# Altium project FL-0004 Power Rail Probe.PrjPcb (part 2 of 3)

## Sheet Microcontroller.SchDoc: Microcontroller and HMI
size Tabloid; Organization: Davis Designs; Address1: Flycatcher Labs; SheetNumber: 3; SheetTotal: 6
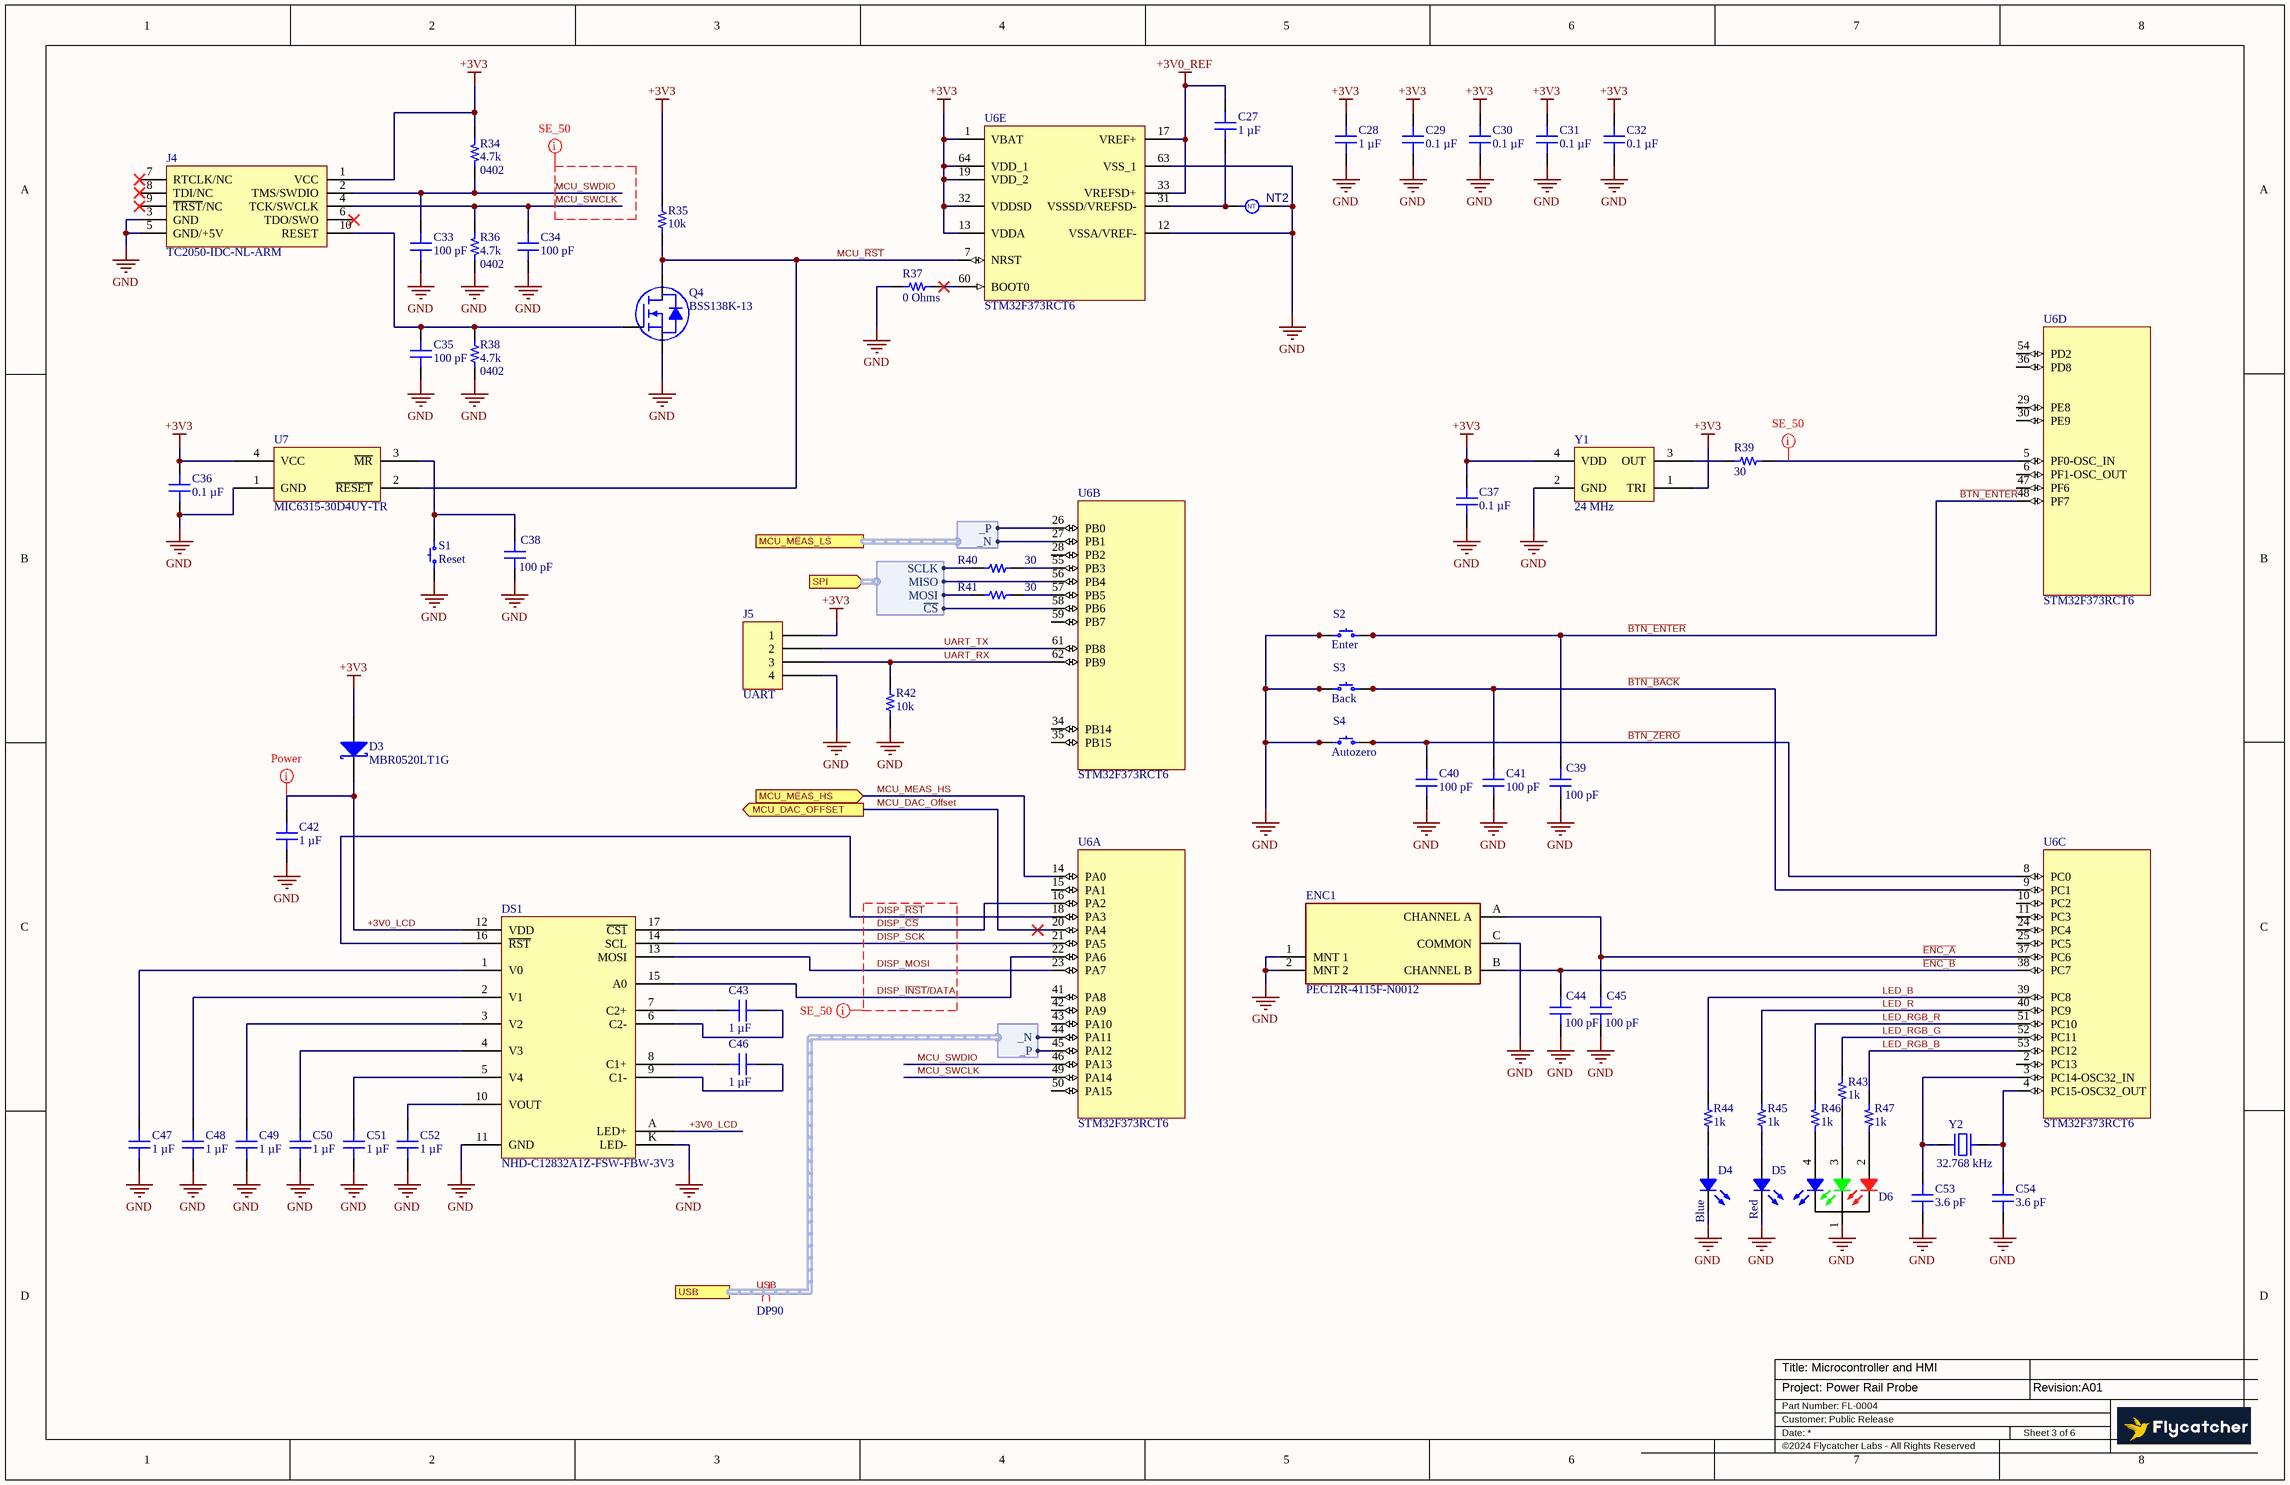
[diagram p3: Microcontroller.SchDoc]

### Parts
C27  1 µF  [MURATA GRM155 0402_1005]
C28  1 µF  [MURATA GRM155 0402_1005]
C29  0.1 µF  [MURATA GRM155 0402_1005]
C30  0.1 µF  [MURATA GRM155 0402_1005]
C31  0.1 µF  [MURATA GRM155 0402_1005]
C32  0.1 µF  [MURATA GRM155 0402_1005]
C33  100 pF  [MURATA GCM155 0402_1005]
C34  100 pF  [MURATA GCM155 0402_1005]
C35  100 pF  [MURATA GCM155 0402_1005]
C36  0.1 µF  [MURATA GRM155 0402_1005]
C37  0.1 µF  [MURATA GRM155 0402_1005]
C38  100 pF  [MURATA GCM155 0402_1005]
C39  100 pF  [MURATA GCM155 0402_1005]
C40  100 pF  [MURATA GCM155 0402_1005]
C41  100 pF  [MURATA GCM155 0402_1005]
C42  1 µF  [MURATA GRM155 0402_1005]
C43  1 µF  [MURATA GRM155 0402_1005]
C44  100 pF  [MURATA GCM155 0402_1005]
C45  100 pF  [MURATA GCM155 0402_1005]
C46  1 µF  [MURATA GRM155 0402_1005]
C47  1 µF  [MURATA GRM155 0402_1005]
C48  1 µF  [MURATA GRM155 0402_1005]
C49  1 µF  [MURATA GRM155 0402_1005]
C50  1 µF  [MURATA GRM155 0402_1005]
C51  1 µF  [MURATA GRM155 0402_1005]
C52  1 µF  [MURATA GRM155 0402_1005]
C53  3.6 pF  [MURATA GJM155 0402_1005]
C54  3.6 pF  [MURATA GJM155 0402_1005]
D3  MBR0520LT1G  [ONSC-SOD-123-2-425-04_V]
D4  Blue  [LED 0402_1005 BLUE]
D5  Red  [LED 0402_1005 RED]
D6  APTF1616LSEKJ3ZGKQBC  [APTF1616LSEKJ3ZGKQBC-Footprint-1]  (value not drawn)
DS1  NHD-C12832A1Z-FSW-FBW-3V3  [NHD-C12832A1Z WHITE]
ENC1  PEC12R-4115F-N0012  [FP-PEC12R-4115F-N0012-MFG]
J4  TC2050-IDC-NL-ARM  [TC2050-IDC-NL-Footprint-1]  (no BOM)
J5  UART  [HARWIN M20-9960445]
NT2  Net Tie 10x8mil  [New footprint 1]  (value not drawn)  (net tie, no BOM)
Q4  BSS138K-13  [DIODES SOT-23-3]
R34  4.7k  Supplier Device Package: 0402  [RES 0402_1005]
R35  10k  [RES 0402_1005]
R36  4.7k  Supplier Device Package: 0402  [RES 0402_1005]
R37  0 Ohms  [RES 0402_1005]
R38  4.7k  Supplier Device Package: 0402  [RES 0402_1005]
R39  30  [RES 0402_1005]
R40  30  [RES 0402_1005]
R41  30  [RES 0402_1005]
R42  10k  [RES 0402_1005]
R43  1k  [RES 0402_1005]
R44  1k  [RES 0402_1005]
R45  1k  [RES 0402_1005]
R46  1k  [RES 0402_1005]
R47  1k  [RES 0402_1005]
S1  Reset  [C&K KSS]
S2  Enter  [OMRON B3FS-1012P]
S3  Back  [OMRON B3FS-1012P]
S4  Autozero  [OMRON B3FS-1012P]
U6  STM32F373RCT6  [STM-LQFP64_M]  (parts A,B,C,D,E of 5)
U7  MIC6315-30D4UY-TR  [MICROCHIP SOT-143-4]
Y1  24 MHz  [ABRACON ASE]
Y2  32.768 kHz  [ABRACON ABS06]

### Ports
MCU_DAC_OFFSET (out), MCU_MEAS_HS (in), MCU_MEAS_LS (harness DP), SPI (in, harness SPI), USB (harness DP)

### Harnesses
DP: _P, _N
SPI: MOSI, MISO, ~{CS}, SCLK

### Nets
+3V0_REF: C27.2 U6.17(VREF+) U6.33(VREFSD+)
+3V3: C28.2 C29.2 C30.2 C31.2 C32.2 C36.2 C37.2 D3.1(A) J4.1(VCC) J5.1 R34.2 R35.2 U6.1(VBAT) U6.13(VDDA) U6.19(VDD_2) U6.32(VDDSD) U6.64(VDD_1) U7.4(VCC) Y1.1(TRI) Y1.4(VDD)
GND: C28.1 C29.1 C30.1 C31.1 C32.1 C33.1 C34.1 C35.1 C36.1 C37.1 C38.1 C39.1 C40.1 C41.1 C42.1 C44.1 C45.1 C47.1 C48.1 C49.1 C50.1 C51.1 C52.1 C53.1 C54.1 D4.2 D5.2 D6.1(K) DS1.11(GND) DS1.K(LED-) ENC1.1(MNT_1) ENC1.2(MNT_2) ENC1.C(COMMON) J4.3(GND) J4.5(GND/+5V) J5.4 NT2.2 Q4.2(S) R36.1 R37.1 R38.1 R42.1 S1.1 S2.1 S2.2 S3.1 S3.2 S4.1 S4.2 U6.12(VSSA/VREF-) U6.63(VSS_1) U7.1(GND) Y1.2(GND)
+3V0_LCD: C42.2 D3.2(K) DS1.12(VDD) DS1.A(LED+)
~{BTN_BACK}: C41.2 S3.3 S3.4 U6.9(PC1)
~{BTN_ENTER}: C39.2 S2.3 S2.4 U6.48(PF7)
~{BTN_ZERO}: C40.2 S4.3 S4.4 U6.8(PC0)
~{ENC_A}: C45.2 ENC1.A(CHANNEL_A) U6.37(PC6)
~{ENC_B}: C44.2 ENC1.B(CHANNEL_B) U6.38(PC7)
DISP_~{CS}: DS1.17(~{CS1}) U6.16(PA2)
DISP_~{INST}/DATA: DS1.15(A0) U6.22(PA6)
DISP_MOSI: DS1.13(MOSI) U6.23(PA7)
DISP_~{RST}: DS1.16(~{RST}) U6.18(PA3)
DISP_SCK: DS1.14(SCL) U6.21(PA5)
LED_B: R44.2 U6.39(PC8)
LED_R: R45.2 U6.40(PC9)
LED_RGB_B: R47.2 U6.53(PC12)
LED_RGB_G: R43.2 U6.52(PC11)
LED_RGB_R: R46.2 U6.51(PC10)
MCU_DAC_Offset: U6.20(PA4) ; port MCU_DAC_OFFSET
MCU_MEAS_HS: U6.14(PA0) ; port MCU_MEAS_HS
MCU_MEAS_LS._N: U6.27(PB1) ; port MCU_MEAS_LS._N
MCU_MEAS_LS._P: U6.26(PB0) ; port MCU_MEAS_LS._P
MCU_~{RST}: Q4.3(D) R35.1 U6.7(NRST) U7.2(~{RESET})
MCU_SWCLK: C34.2 J4.4(TCK/SWCLK) R36.2 U6.49(PA14)
MCU_SWDIO: C33.2 J4.2(TMS/SWDIO) R34.1 U6.46(PA13)
SPI_TRIM~{.}CS: U6.58(PB6) ; port SPI.~{CS}
SPI_TRIM.MISO: U6.56(PB4) ; port SPI.MISO
SPI_TRIM.MOSI: R41.1 ; port SPI.MOSI
SPI_TRIM.SCLK: R40.1 ; port SPI.SCLK
UART_RX: J5.3 R42.2 U6.62(PB9)
UART_TX: J5.2 U6.61(PB8)
USB._N: U6.44(PA11) ; port USB._N
USB._P: U6.45(PA12) ; port USB._P
NetC27_1: C27.1 NT2.1 U6.31(VSSSD/VREFSD-)
NetC35_2: C35.2 J4.10(RESET) Q4.1(G) R38.2
NetC38_2: C38.2 S1.2 U7.3(~{MR})
NetC43_1: C43.1 DS1.6(C2-)
NetC43_2: C43.2 DS1.7(C2+)
NetC46_1: C46.1 DS1.9(C1-)
NetC46_2: C46.2 DS1.8(C1+)
NetC47_2: C47.2 DS1.1(V0)
NetC48_2: C48.2 DS1.2(V1)
NetC49_2: C49.2 DS1.3(V2)
NetC50_2: C50.2 DS1.4(V3)
NetC51_2: C51.2 DS1.5(V4)
NetC52_2: C52.2 DS1.10(VOUT)
NetC53_2: C53.2 U6.3(PC14-OSC32_IN) Y2.1
NetC54_2: C54.2 U6.4(PC15-OSC32_OUT) Y2.2
NetD4_1: D4.1 R44.1
NetD5_1: D5.1 R45.1
NetD6_2: D6.2(R) R47.1
NetD6_3: D6.3(G) R43.1
NetD6_4: D6.4(B) R46.1
NetR37_2: R37.2 U6.60(BOOT0)
NetR39_1: R39.1 Y1.3(OUT)
NetR39_2: R39.2 U6.5(PF0-OSC_IN)
NetR40_2: R40.2 U6.55(PB3)
NetR41_2: R41.2 U6.57(PB5)

Not connected (* = marked no-connect by the designer): J4 6(TDO/SWO)* 7(RTCLK/NC)* 8(TDI/NC)* 9(~{TRST}/NC)*; U6 2(PC13) 6(PF1-OSC_OUT) 10(PC2) 11(PC3) 15(PA1) 24(PC4) 25(PC5) 28(PB2) 29(PE8) 30(PE9) 34(PB14) 35(PB15) 36(PD8) 41(PA8) 42(PA9) 43(PA10) 47(PF6) 50(PA15) 54(PD2) 59(PB7)

### Buses and harness runs
harness USB = port USB

### Layout directives
differential pair; differential pair class DP90: (no net found under the mark)
net class SE_50: DISP_MOSI, DISP_SCK, DISP_~{CS}, DISP_~{INST}/DATA, DISP_~{RST}, MCU_SWCLK, MCU_SWDIO, NetR39_2
net class Power: +3V0_LCD

### Notes on the sheet
- (in symbol CMP-009-00116-4) NT

### Library data of the parts
C27 C28 C42 C43 C46-C52 = GRM155R61E105MA12D: CAP CER 1UF 25V X5R 0402; manufacturer: Murata Electronics; Tolerance: ±20%; Part Number: GRM155R61E105MA12D; Value: 1 µF; Applications: General Purpose; Capacitance: 1 µF; componentlink1description: Datasheet; componentlink1url: https://search.murata.co.jp/Ceramy/image/img/A01X/G101/ENG/GRM155R61E105MA12-01.pdf; componentlink2description: DigiKey Link; componentlink2url: https://www.digikey.com/en/products/detail/murata-electronics/GRM155R61E105MA12D/4905141; Device Package: 0402 (1005 Metric); lastupdated: 7/25/2024 4:50:24 AM; Lifecycle Status: Active; Minimum Order: 1; Mounting Type: Surface Mount, MLCC; Operating Temperature: -55°C ~ 85°C; Package / Case: 0402 (1005 Metric); packaging: TapeAndReel; partid: 3014; Part Status: Active; price: 0.01; series: GRM; Size / Dimension: 0.039" L x 0.020" W (1.00mm x 0.50mm); Supplier 1: DigiKey; Supplier Part Number 1: 490-10018-1-ND; Temperature Coefficient: X5R; Thickness (Max): 0.022" (0.55mm); Voltage - Rated: 25V
C29-C32 C36 C37 = GRM155R61H104KE19D: CAP CER 0.1UF 50V X5R 0402; manufacturer: Murata Electronics; Tolerance: ±10%; Part Number: GRM155R61H104KE19D; Value: 0.1 µF; Applications: General Purpose; Capacitance: 0.1 µF; componentlink1description: Datasheet; componentlink1url: https://search.murata.co.jp/Ceramy/image/img/A01X/G101/ENG/GRM155R61H104KE19-01.pdf; componentlink2description: DigiKey Link; componentlink2url: https://www.digikey.com/en/products/detail/murata-electronics/GRM155R61H104KE19D/5360887; Device Package: 0402 (1005 Metric); lastupdated: 7/25/2024 4:50:24 AM; Lifecycle Status: Active; Minimum Order: 1; Mounting Type: Surface Mount, MLCC; Operating Temperature: -55°C ~ 85°C; Package / Case: 0402 (1005 Metric); packaging: TapeAndReel; partid: 2975; Part Status: Active; price: 0.01; series: GRM; Size / Dimension: 0.039" L x 0.020" W (1.00mm x 0.50mm); Supplier 1: DigiKey; Supplier Part Number 1: 490-11917-1-ND; Temperature Coefficient: X5R; Thickness (Max): 0.022" (0.55mm); Voltage - Rated: 50V
C33-C35 C38-C41 C44 C45 = GCM1555C1H101FA16D: CAP CER 100PF 50V C0G/NP0 0402; manufacturer: Murata Electronics; Temperature Coefficient: C0G, NP0; Tolerance: ±1%; Part Number: GCM1555C1H101FA16D; Value: 100 pF; Applications: Automotive; Capacitance: 100 pF; componentlink1description: Datasheet; componentlink1url: https://search.murata.co.jp/Ceramy/image/img/A01X/G101/ENG/GCM1555C1H101FA16-01.pdf; componentlink2description: DigiKey Link; componentlink2url: https://www.digikey.com/en/products/detail/murata-electronics/GCM1555C1H101FA16D/6605978; Device Package: 0402 (1005 Metric); lastupdated: 7/20/2024 2:04:18 AM; Lifecycle Status: Active; Minimum Order: 1; Mounting Type: Surface Mount, MLCC; Operating Temperature: -55°C ~ 125°C; Package / Case: 0402 (1005 Metric); packaging: TapeAndReel; partid: 7484; Part Status: Active; price: 0.01; Ratings: AEC-Q200; series: GCM; Size / Dimension: 0.039" L x 0.020" W (1.00mm x 0.50mm); Supplier 1: DigiKey; Supplier Part Number 1: 490-14349-1-ND; Thickness (Max): 0.022" (0.55mm); Voltage - Rated: 50V
C53 C54 = GJM1555C1H3R6CB01D: CAP CER 3.6PF 50V C0G/NP0 0402; manufacturer: Murata Electronics; Temperature Coefficient: C0G, NP0; Tolerance: ±0.25pF; Part Number: GJM1555C1H3R6CB01D; Value: 3.6 pF; Applications: RF, Microwave, High Frequency; Capacitance: 3.6 pF; componentlink1description: Datasheet; componentlink1url: https://search.murata.co.jp/Ceramy/image/img/A01X/G101/ENG/GJM1555C1H3R6CB01-01.pdf; componentlink2description: DigiKey Link; componentlink2url: https://www.digikey.com/en/products/detail/murata-electronics/GJM1555C1H3R6CB01D/702289; Device Package: 0402 (1005 Metric); Features: High Q, Low Loss; lastupdated: 7/20/2024 12:08:45 AM; Lifecycle Status: Active; Minimum Order: 1; Mounting Type: Surface Mount, MLCC; Operating Temperature: -55°C ~ 125°C; Package / Case: 0402 (1005 Metric); packaging: TapeAndReel; partid: 8570; Part Status: Active; price: 0.01; series: GJM; Size / Dimension: 0.039" L x 0.020" W (1.00mm x 0.50mm); Supplier 1: DigiKey; Supplier Part Number 1: 490-3096-1-ND; Thickness (Max): 0.022" (0.55mm); Voltage - Rated: 50V
D3 = CMP-004-00003-2: Schottky Power Rectifier, 20 V, 5.5 A, -65 to 125 degC, 2-Pin SMD, RoHS, Tape and Reel; Manufacturer: ON Semiconductor; Forward Current: 500mA; Peak Reverse Current: 250uA; Elements: 1; Forward Voltage: 385mV; Max Surge Current: 5.5A; Max Operating Temperature: 125°C; Min Operating Temperature: -65°C; Mounting Technology: SM; Datasheet URL: http://www.onsemi.cn/pub_link/Collateral/MBR0520LT1-D.PDF; RoHS Compliant: True; Pins: 2; Package Quantity: 3000; Case/Package: SOD; Package Reference: SOD-123-2-425-04; Package Description: 2-Pin Surface Mount Device, Body 2.69 x 1.6 mm; Packaging: TapeandReel; Manufacturer URL: http://www.onsemi.com/; Datasheet Version: Rev. 6, 01/2012
D4 = SML-LXR0401USBW5MA: 1.0X0.55X0.3 MM. SMT SIDE VIEW L; Manufacturer: Lumex Opto/Components Inc.; Configuration: Independent; Current - Test: 5mA; Lens Color: White; Lens Size: 1.00mm x 0.30mm; Lens Style: Rectangle with Flat Top; Lens Transparency: Diffused; Millicandela Rating: 28mcd; Viewing Angle: 145°; Voltage - Forward (Vf) (Typ): 2.8V; Wavelength - Peak: 470nm; Part Number: SML-LXR0401USBW5MA; Color: Blue; ComponentLink1Description: Datasheet; ComponentLink1URL: https://media.digikey.com/pdf/Data%20Sheets/Lumex%20PDFs/SML-LXR0401USBW5MA_Dwg_RevA_2-10-20.pdf; ComponentLink2Description: DigiKey Link; ComponentLink2URL: https://www.digikey.com/en/products/detail/lumex-opto-components-inc/SML-LXR0401USBW5MA/12091299; Device Package: 0402 (1005 Metric); Height (Max): 0.30mm; LastUpdated: 3/11/2024 7:49:46 AM; Lifecycle Status: Active; Minimum Order: 1; Mounting Type: Surface Mount; Package / Case: 0402 (1005 Metric); Packaging: TapeAndReel; PartId: 1155; Part Status: Active; Price: 0.09; Series: -; Size / Dimension: 1.00mm L x 0.55mm W; Supplier 1: DigiKey; Supplier Part Number 1: 67-SML-LXR0401USBW5MACT-ND; Value: Blue
D5 = SML-P11VTT86R: LED RED CLEAR 1006 SMD; Manufacturer: Rohm Semiconductor; Configuration: Standard; Current - Test: 1mA; Lens Color: Colorless; Lens Size: 0.60mm; Lens Style: Square with Flat Top; Millicandela Rating: 4mcd; Voltage - Forward (Vf) (Typ): 1.8V; Wavelength - Dominant: 626nm; Part Number: SML-P11VTT86R; Color: Red; ComponentLink1Description: Datasheet; ComponentLink1URL: https://www.rohm.com/datasheet/SML-P11MT(R); ComponentLink2Description: DigiKey Link; ComponentLink2URL: https://www.digikey.com/en/products/detail/rohm-semiconductor/SML-P11VTT86R/4862231; Device Package: 0402 (1005 Metric); Height (Max): 0.25mm; LastUpdated: 3/11/2024 7:51:33 AM; Lens Transparency: Clear; Lifecycle Status: Active; Minimum Order: 1; Mounting Type: Surface Mount; Package / Case: 0402 (1005 Metric); Packaging: TapeAndReel; PartId: 1007; Part Status: Active; Price: 0.11; Series: PicoLED™; Size / Dimension: 1.00mm L x 0.60mm W; Supplier 1: DigiKey; Supplier Part Number 1: 846-SML-P11VTT86RCT-ND; Supplier Device Package: 1006 (0402); Value: Red
D6 = CMP-00026-00001-2: Heli Colour; 1.6X1.6MM Low Current Rgb SMD Led; Forward Voltage: 2.7V; Test Current: 2mA; Lens Color: Colorless; Dominant Wavelength: 465nm; Viewing Angle: 120°; Lens Transparency: Clear; Color: Blue,Green,Red; Luminous Intensity: 14mcd; Case/Package: 0606; Series: -; Length: 1.6mm; Width: 1.6mm; Height: 0.9mm; Packaging: Tape and Reel; Mounting Technology: Surface Mount; RoHS Compliant: Yes
DS1 = NHD-C12832A1Z-FSW-FBW-3V3: LCD COG GRAPHIC 128X32; Manufacturer: Newhaven Display Intl; Background Color: White (Black - Inverted); Backlight: LED - White; Display Mode: Transflective; Display Type: FSTN - Film Super-Twisted Nematic; Interface: SPI; Viewing Area: 36.00mm W x 12.00mm H; Part Number: NHD-C12832A1Z-FSW-FBW-3V3; ComponentLink1Description: Datasheet; ComponentLink1URL: http://www.newhavendisplay.com/specs/NHD-C12832A1Z-FSW-FBW-3V3.pdf; ComponentLink2Description: DigiKey Link; ComponentLink2URL: //digikey.com/product-detail/en/newhaven-display-intl/NHD-C12832A1Z-FSW-FBW-3V3/NHD-C12832A1Z-FSW-FBW-3V3-ND/2059236; LastUpdated: 12/4/2019 12:49:03 PM; Lifecycle Status: 0; Minimum Order: 1; Packaging: Unknown; PartId: 1; Part Status: Active; Price: 11.53; Series: -; Supplier 1: DigiKey; Supplier Part Number 1: NHD-C12832A1Z-FSW-FBW-3V3-ND
ENC1 = CMP-011-00013-2: Rotary Encoder Mechanical 12PPR; Detent: Yes; Number of Channels: 2; Built in Switch: No; Output Type: Quadrature,Incremental; Pulses per Revolution: 12; Length: 20mm; Min Operating Temperature: -30°C; Package Quantity: 75; Termination: PC Pin; Width: 12.5mm; Packaging: Bulk; Encoder Type: Mechanical; RoHS Compliant: Yes; Height: 13.4mm; Series: PEC12R; Mounting Technology: Through Hole,PCB; Max Operating Temperature: 70°C; Orientation: Vertical
J4 = CMP-002-00073-3: Plug Of Nails 10PIN JTAG/SWD connector; Series: Plug-Of-Nails™; ComponentLink1Description: Datasheet; ComponentLink2Description: ARM Adapter; ComponentLink2URL: https://www.tag-connect.com/wp-content/uploads/bsk-pdf-manager/2021/02/TC2050-ARM2010-2021.pdf; ComponentLink1URL: https://www.tag-connect.com/wp-content/uploads/bsk-pdf-manager/TC2050-IDC-NL_Datasheet_8.pdf
J5 = M20-9960445: CONN HEADER R/A 4POS 2.54MM; Manufacturer: Harwin Inc.; Connector Type: Header, Cuttable; Contact Length - Mating: 0.240" (6.10mm); Contact Length - Post: 0.118" (3.00mm); Current Rating (Amps): 3A per Contact; Material Flammability Rating: UL94 V-0; Number of Positions: 4; Number of Positions Loaded: All; Pitch - Mating: 0.100" (2.54mm); Row Spacing - Mating: -40°C ~ 105°C; Shrouding: Unshrouded; Style: Board to Board or Cable; Part Number: M20-9960445; ComponentLink1Description: Datasheet; ComponentLink1URL: https://cdn.harwin.com/pdfs/Harwin_PC_Connectors_M20.pdf; ComponentLink2Description: DigiKey Link; ComponentLink2URL: https://www.digikey.com/en/products/detail/harwin-inc/M20-9960445/3921052; Contact Finish - Mating: Gold; Contact Material: Brass; Contact Shape: Square; Contact Type: Male Pin; Fastening Type: Push-Pull; Insulation Color: Black; Insulation Height: 0.100" (2.54mm); Insulation Material: Polyamide (PA6T), Nylon 6T; LastUpdated: 9/21/2022 7:23:20 PM; Lifecycle Status: Active; Minimum Order: 1; Mounting Type: Through Hole, Right Angle; Number of Rows: 1; Operating Temperature: -40°C ~ 105°C; Packaging: Bulk; PartId: 167; Part Status: Active; Price: 0.11; Series: M20; Supplier 1: DigiKey; Supplier Part Number 1: 952-3286-ND; Termination: Solder
NT2 = CMP-009-00116-4: Pins: 2; Max Operating Temperature: 155°C; Min Operating Temperature: -55°C; ClassName: NetTie
Q4 = BSS138K-13: MOSFET N-CH 50V 310MA SOT23; Manufacturer: Diodes Incorporated; Current - Continuous Drain (Id) @ 25°C: 310mA (Ta); Drive Voltage (Max Rds On,  Min Rds On): 10V; FET Type: N-Channel; Gate Charge (Qg) (Max) @ Vgs: 0.95 nC @ 10 V; Input Capacitance (Ciss) (Max) @ Vds: 23.2 pF @ 25 V; Power Dissipation (Max): 380mW (Ta); Rds On (Max) @ Id, Vgs: 3.5Ohm @ 220mA, 10V; Vgs (Max): ±20V; Vgs(th) (Max) @ Id: 1.5V @ 250µA; Part Number: BSS138K-13; ComponentLink1Description: Datasheet; ComponentLink1URL: https://www.diodes.com/assets/Datasheets/BSS138K.pdf; ComponentLink2Description: DigiKey Link; ComponentLink2URL: https://www.digikey.com/en/products/detail/diodes-incorporated/BSS138K-13/9089764; Drain to Source Voltage (Vdss): 50 V; LastUpdated: 6/3/2024 8:15:18 PM; Lifecycle Status: Active; Minimum Order: 1; Mounting Type: Surface Mount; Operating Temperature: -55°C ~ 150°C (TJ); Package / Case: TO-236-3, SC-59, SOT-23-3; Packaging: TapeAndReel; Part Status: Active; Price: 0.03; Series: -; Supplier 1: DigiKey; Supplier Part Number 1: BSS138K-13DICT-ND; Supplier Device Package: SOT-23-3; Technology: MOSFET (Metal Oxide)
R34 R36 R38 = RMCF0402FT4K70: RES 4.7K OHM 1% 1/16W 0402; Manufacturer: Stackpole Electronics Inc; Value: 4.7 kOhms; Power (Watts): 0.063W, 1/16W; Temperature Coefficient: ±100ppm/°C; Part Number: RMCF0402FT4K70; ComponentLink1Description: Datasheet; ComponentLink1URL: https://www.seielect.com/catalog/sei-packaging.pdf; ComponentLink2Description: DigiKey Link; ComponentLink2URL: https://www.digikey.com/en/products/detail/stackpole-electronics-inc/RMCF0402FT4K70/1761370; Composition: Thick Film; Device Package: 0402 (1005 Metric); Features: Automotive AEC-Q200; Height - Seated (Max): 0.016" (0.40mm); LastUpdated: 2/9/2024 8:30:13 PM; Lifecycle Status: Active; Minimum Order: 1; Number of Terminations: 2; Operating Temperature: -55°C ~ 155°C; Package / Case: 0402 (1005 Metric); Packaging: CutTape; PartId: 4917; Part Status: Active; Price: 0.01; Ratings: AEC-Q200; Resistance: 4.7 kOhms; Series: RMCF; Size / Dimension: 0.039" L x 0.020" W (1.00mm x 0.50mm); Supplier 1: DigiKey; Supplier Part Number 1: RMCF0402FT4K70CT-ND; Tolerance: ±1%
R35 R42 = ERA-2VRW1002X: RES 10K OHM 0.05% 1/10W 0402; Manufacturer: Panasonic Electronic Components; Value: 10 kOhms; Power (Watts): 0.1W, 1/10W; Temperature Coefficient: ±10ppm/°C; Part Number: ERA-2VRW1002X; ComponentLink1Description: Datasheet; ComponentLink1URL: https://api.pim.na.industrial.panasonic.com/file_stream/main/fileversion/9152; ComponentLink2Description: DigiKey Link; ComponentLink2URL: https://www.digikey.com/en/products/detail/panasonic-electronic-components/ERA-2VRW1002X/12085128; Composition: Thin Film; Device Package: 0402 (1005 Metric); Height - Seated (Max): 0.016" (0.40mm); LastUpdated: 2/9/2024 8:28:44 PM; Lifecycle Status: Active; Minimum Order: 1; Number of Terminations: 2; Operating Temperature: -55°C ~ 155°C; Package / Case: 0402 (1005 Metric); Packaging: TapeAndReel; PartId: 70282; Part Status: Active; Price: 0.21; Resistance: 10 kOhms; Series: ERA-2V; Size / Dimension: 0.039" L x 0.020" W (1.00mm x 0.50mm); Supplier 1: DigiKey; Supplier Part Number 1: 10-ERA-2VRW1002XCT-ND; Supplier Device Package: 0402; Tolerance: ±0.05%; Features: Anti-Sulfur, Automotive AEC-Q200; Ratings: AEC-Q200
R37 = CRCW04020000ZSTD: RES SMD 0 OHM JUMPER 1/16W 0402; Manufacturer: Vishay Dale; Power (Watts): 0.063W, 1/16W; Part Number: CRCW04020000ZSTD; Value: 0 Ohms; ComponentLink1Description: Datasheet; ComponentLink1URL: http://www.vishay.com/docs/20008/dcrcw.pdf; ComponentLink2Description: DigiKey Link; ComponentLink2URL: https://www.digikey.com/en/products/detail/vishay-dale/CRCW04020000ZSTD/1226552; Composition: Thick Film; Device Package: 0402 (1005 Metric); Features: Automotive AEC-Q200; Height - Seated (Max): 0.016" (0.40mm); LastUpdated: 2/9/2024 8:29:49 PM; Lifecycle Status: Active; Minimum Order: 1; Number of Terminations: 2; Operating Temperature: -55°C ~ 155°C; Package / Case: 0402 (1005 Metric); Packaging: TapeAndReel; PartId: 12375; Part Status: Active; Price: 0.01; Ratings: AEC-Q200; Resistance: 0 Ohms; Series: CRCW; Size / Dimension: 0.039" L x 0.020" W (1.00mm x 0.50mm); Supplier 1: DigiKey; Supplier Part Number 1: 541-2952-1-ND; Supplier Device Package: 0402; Tolerance: Jumper
R39-R41 = CRCW040230R0FKED: RES SMD 30 OHM 1% 1/16W 0402; Manufacturer: Vishay Dale; Value: 30 Ohms; Power (Watts): 0.063W, 1/16W; Temperature Coefficient: ±100ppm/°C; Part Number: CRCW040230R0FKED; ComponentLink1Description: Datasheet; ComponentLink1URL: http://www.vishay.com/docs/20035/dcrcwe3.pdf; ComponentLink2Description: DigiKey Link; ComponentLink2URL: https://www.digikey.com/en/products/detail/vishay-dale/CRCW040230R0FKED/1177831; Composition: Thick Film; Device Package: 0402 (1005 Metric); Features: Automotive AEC-Q200; Height - Seated (Max): 0.016" (0.40mm); LastUpdated: 2/9/2024 8:29:52 PM; Lifecycle Status: Active; Minimum Order: 1; Number of Terminations: 2; Operating Temperature: -55°C ~ 155°C; Package / Case: 0402 (1005 Metric); Packaging: CutTape; PartId: 11185; Part Status: Active; Price: 0.01; Ratings: AEC-Q200; Resistance: 30 Ohms; Series: CRCW; Size / Dimension: 0.039" L x 0.020" W (1.00mm x 0.50mm); Supplier 1: DigiKey; Supplier Part Number 1: 541-30.0LCT-ND; Supplier Device Package: 0402; Tolerance: ±1%
R43-R47 = ERA-2AEB102X: RES SMD 1K OHM 0.1% 1/16W 0402; Manufacturer: Panasonic Electronic Components; Value: 1 kOhms; Power (Watts): 0.063W, 1/16W; Temperature Coefficient: ±25ppm/°C; Part Number: ERA-2AEB102X; ComponentLink1Description: Datasheet; ComponentLink1URL: https://industrial.panasonic.com/cdbs/www-data/pdf/RDM0000/AOA0000C307.pdf; ComponentLink2Description: DigiKey Link; ComponentLink2URL: https://www.digikey.com/en/products/detail/panasonic-electronic-components/ERA-2AEB102X/1706005; Composition: Thin Film; Device Package: 0402 (1005 Metric); Features: Automotive AEC-Q200; Height - Seated (Max): 0.016" (0.40mm); LastUpdated: 2/9/2024 8:30:08 PM; Lifecycle Status: Active; Minimum Order: 1; Number of Terminations: 2; Operating Temperature: -55°C ~ 155°C; Package / Case: 0402 (1005 Metric); Packaging: TapeAndReel; PartId: 6077; Part Status: Active; Price: 0.04; Ratings: AEC-Q200; Resistance: 1 kOhms; Series: ERA-2A; Size / Dimension: 0.039" L x 0.020" W (1.00mm x 0.50mm); Supplier 1: DigiKey; Supplier Part Number 1: P1.0KDCCT-ND; Supplier Device Package: 0402; Tolerance: ±0.1%
S1 = KSS331GLFS: SWITCH TACTILE SPST-NO 0.05A 50V; Manufacturer: C&K; Actuator Orientation: Side Actuated; Actuator Type: Rectangular Button; Contact Rating @ Voltage: 0.05A @ 50VDC; Illumination: Non-Illuminated; Ingress Protection: IP40; Operating Force: 250gf; Outline: 7.60mm x 3.70mm; Switch Function: Off-Mom; Part Number: KSS331GLFS; Circuit: SPST-NO; ComponentLink1Description: Datasheet; ComponentLink1URL: https://dznh3ojzb2azq.cloudfront.net/products/Tactile/KSS/documents/datasheet.pdf; ComponentLink2Description: DigiKey Link; ComponentLink2URL: http://digikey.com/product-detail/en/c-k/KSS331GLFS/401-1101-1-ND/417673; Features: Tactile Feedback; LastUpdated: 4/9/2020 9:55:46 AM; Lifecycle Status: Active; Minimum Order: 1; Mounting Type: Surface Mount, Right Angle; Operating Temperature: -40°C ~ 85°C; Packaging: TapeAndReel; Part Status: Active; Price: 0.35; Series: KSS; Supplier 1: DigiKey; Supplier Part Number 1: 401-1101-1-ND; Termination Style: Gull Wing
S2-S4 = B3FS-1012P: SWITCH TACTILE SPST-NO 0.05A 24V; Manufacturer: Omron Electronics Inc-EMC Div; Actuator Height off PCB, Vertical: 4.30mm; Actuator Orientation: Top Actuated; Actuator Type: Standard; Contact Rating @ Voltage: 0.05A @ 24VDC; Illumination: Non-Illuminated; Operating Force: 150gf; Outline: 6.30mm x 6.00mm; Switch Function: Off-Mom; Part Number: B3FS-1012P; Circuit: SPST-NO; ComponentLink1Description: Datasheet; ComponentLink1URL: https://omronfs.omron.com/en_US/ecb/products/pdf/en-b3fs.pdf; ComponentLink2Description: DigiKey Link; ComponentLink2URL: http://digikey.com/product-detail/en/omron-electronics-inc-emc-div/B3FS-1012P/SW1237CT-ND/2747253; LastUpdated: 3/30/2020 3:12:46 PM; Lifecycle Status: Active; Minimum Order: 1; Mounting Type: Surface Mount; Operating Temperature: -25°C ~ 70°C; Packaging: TapeAndReel; Part Status: Active; Price: 0.35; Series: B3FS; Supplier 1: DigiKey; Supplier Part Number 1: SW1237CT-ND; Termination Style: Gull Wing
U6 = CMP-020-00024-1: IC MCU 32BIT 256KB FLASH 64LQFP; Number of Timers/Counters: 14; Max Power Dissipation: 444mW; Min Supply Voltage: 2V; Data Bus Width: 32b; Peripherals: POR,PWM,WDT,DMA,I2C; Number of SPI Channels: 3; Frequency: 72MHz; Number of Programmable I/O: 52; Number of I2C Channels: 2; Max Supply Voltage: 3.6V; Oscillator Type: Internal; Watchdog Timer: Yes; RAM Size: 32KB; Interface: I2C,SPI,USB,CAN,IrDA,UART,USART,LIN,I2S; Number of USB Channels: 1; Core Architecture: ARM; Max Operating Temperature: 85°C; Memory Format: FLASH; ComponentLink3Description: Programming Manual; Height: 1.45mm; Length: 10.2mm; Width: 10.2mm; Min Operating Temperature: -40°C; Lead Free: Lead Free; RoHS Compliant: Yes; Radiation Hardening: No; Package Quantity: 160; ComponentLink1URL: https://www.st.com/resource/en/datasheet/stm32f373rc.pdf; Memory Size: 256KB; ComponentLink2URL: https://www.st.com/resource/en/reference_manual/rm0313-stm32f37xxx-advanced-armbased-32bit-mcus-stmicroelectronics.pdf; Series: STM32 F3; Reach SVHC Compliant: No; Pins: 64; Number of I/Os: 52; Case/Package: LQFP; ComponentLink2Description: Reference Manual; ComponentLink1Description: Datasheet; Clock Frequency: 72MHz; Packaging: Tray; ComponentLink3URL: https://www.st.com/resource/en/programming_manual/pm0214-stm32-cortexm4-mcus-and-mpus-programming-manual-stmicroelectronics.pdf
U7 = MIC6315-30D4UY-TR: IC SUPERVISOR 1 CHANNEL SOT143; Manufacturer: Microchip Technology; Number of Voltages Monitored: 1; Output: Open Drain or Open Collector; Reset: Active Low; Reset Timeout: 1.1s Minimum; Voltage - Threshold: 3V; Part Number: MIC6315-30D4UY-TR; ComponentLink1Description: Datasheet; ComponentLink1URL: https://ww1.microchip.com/downloads/en/DeviceDoc/MIC6315-Open-Drain-Microprocessor-Reset-Circuit-DS20006450A.pdf; ComponentLink2Description: DigiKey Link; ComponentLink2URL: https://www.digikey.com/en/products/detail/microchip-technology/MIC6315-30D4UY-TR/1617165; LastUpdated: 3/11/2024 8:03:55 AM; Lifecycle Status: Active; Minimum Order: 1; Mounting Type: Surface Mount; Operating Temperature: -40°C ~ 85°C (TA); Packaging: TapeAndReel; Part Status: Active; Price: 0.41; Series: -; Supplier 1: DigiKey; Supplier Part Number 1: 150-MIC6315-30D4UY-TRCT-ND; Supplier Device Package: SOT-143; Type: Simple Reset/Power-On Reset
Y1 = ASE-24.000MHZ-L-R-T: XTAL OSC XO 24.0000MHZ CMOS SMD; Manufacturer: Abracon LLC; Base Resonator: Crystal; Current - Supply (Max): 13mA; Frequency Stability: ±25ppm; Function: Enable/Disable; Voltage - Supply: 3.3V; Part Number: ASE-24.000MHZ-L-R-T; ComponentLink1Description: Datasheet; ComponentLink1URL: https://abracon.com/Oscillators/ASEseries.pdf; ComponentLink2Description: DigiKey Link; ComponentLink2URL: https://www.digikey.com/en/products/detail/abracon-llc/ASE-24-000MHZ-L-R-T/2637768; Frequency: 24 MHz; Height - Seated (Max): 0.047" (1.20mm); LastUpdated: 6/3/2024 8:02:10 PM; Lifecycle Status: Active; Minimum Order: 1; Mounting Type: Surface Mount; Operating Temperature: -40°C ~ 85°C; Output: CMOS; Packaging: TapeAndReel; PartId: 296; Part Status: Active; Price: 0.51; Series: ASE; Size / Dimension: 0.126" L x 0.098" W (3.20mm x 2.50mm); Supplier 1: DigiKey; Supplier Part Number 1: 535-ASE-24.000MHZ-L-R-TCT-ND; Type: XO (Standard); Value: 24 MHz
Y2 = ABS06-32.768KHZ-1-T: CRYSTAL 32.7680KHZ 12.5PF SMD; Manufacturer: Abracon LLC; ESR (Equivalent Series Resistance): 90 kOhms; Frequency Tolerance: ±10ppm; Operating Mode: Fundamental; Part Number: ABS06-32.768KHZ-1-T; ComponentLink1Description: Datasheet; ComponentLink1URL: https://abracon.com/Resonators/ABS06.pdf; ComponentLink2Description: DigiKey Link; ComponentLink2URL: https://www.digikey.com/en/products/detail/abracon-llc/ABS06-32-768KHZ-1-T/2217994; Frequency: 32.768 kHz; Height - Seated (Max): 0.024" (0.60mm); LastUpdated: 6/3/2024 8:02:03 PM; Lifecycle Status: Active; Load Capacitance: 12.5pF; Minimum Order: 1; Mounting Type: Surface Mount; Operating Temperature: -40°C ~ 85°C; Package / Case: 2-SMD, No Lead; Packaging: TapeAndReel; PartId: 370; Part Status: Active; Price: 0.33; Series: ABS06; Size / Dimension: 0.079" L x 0.047" W (2.00mm x 1.20mm); Supplier 1: DigiKey; Supplier Part Number 1: 535-10248-1-ND; Type: kHz Crystal (Tuning Fork); Value: 32.768 kHz

## Sheet Power.SchDoc: Power Supplies
size Tabloid; Organization: Davis Designs; Address1: Flycatcher Labs; SheetNumber: 4; SheetTotal: 6
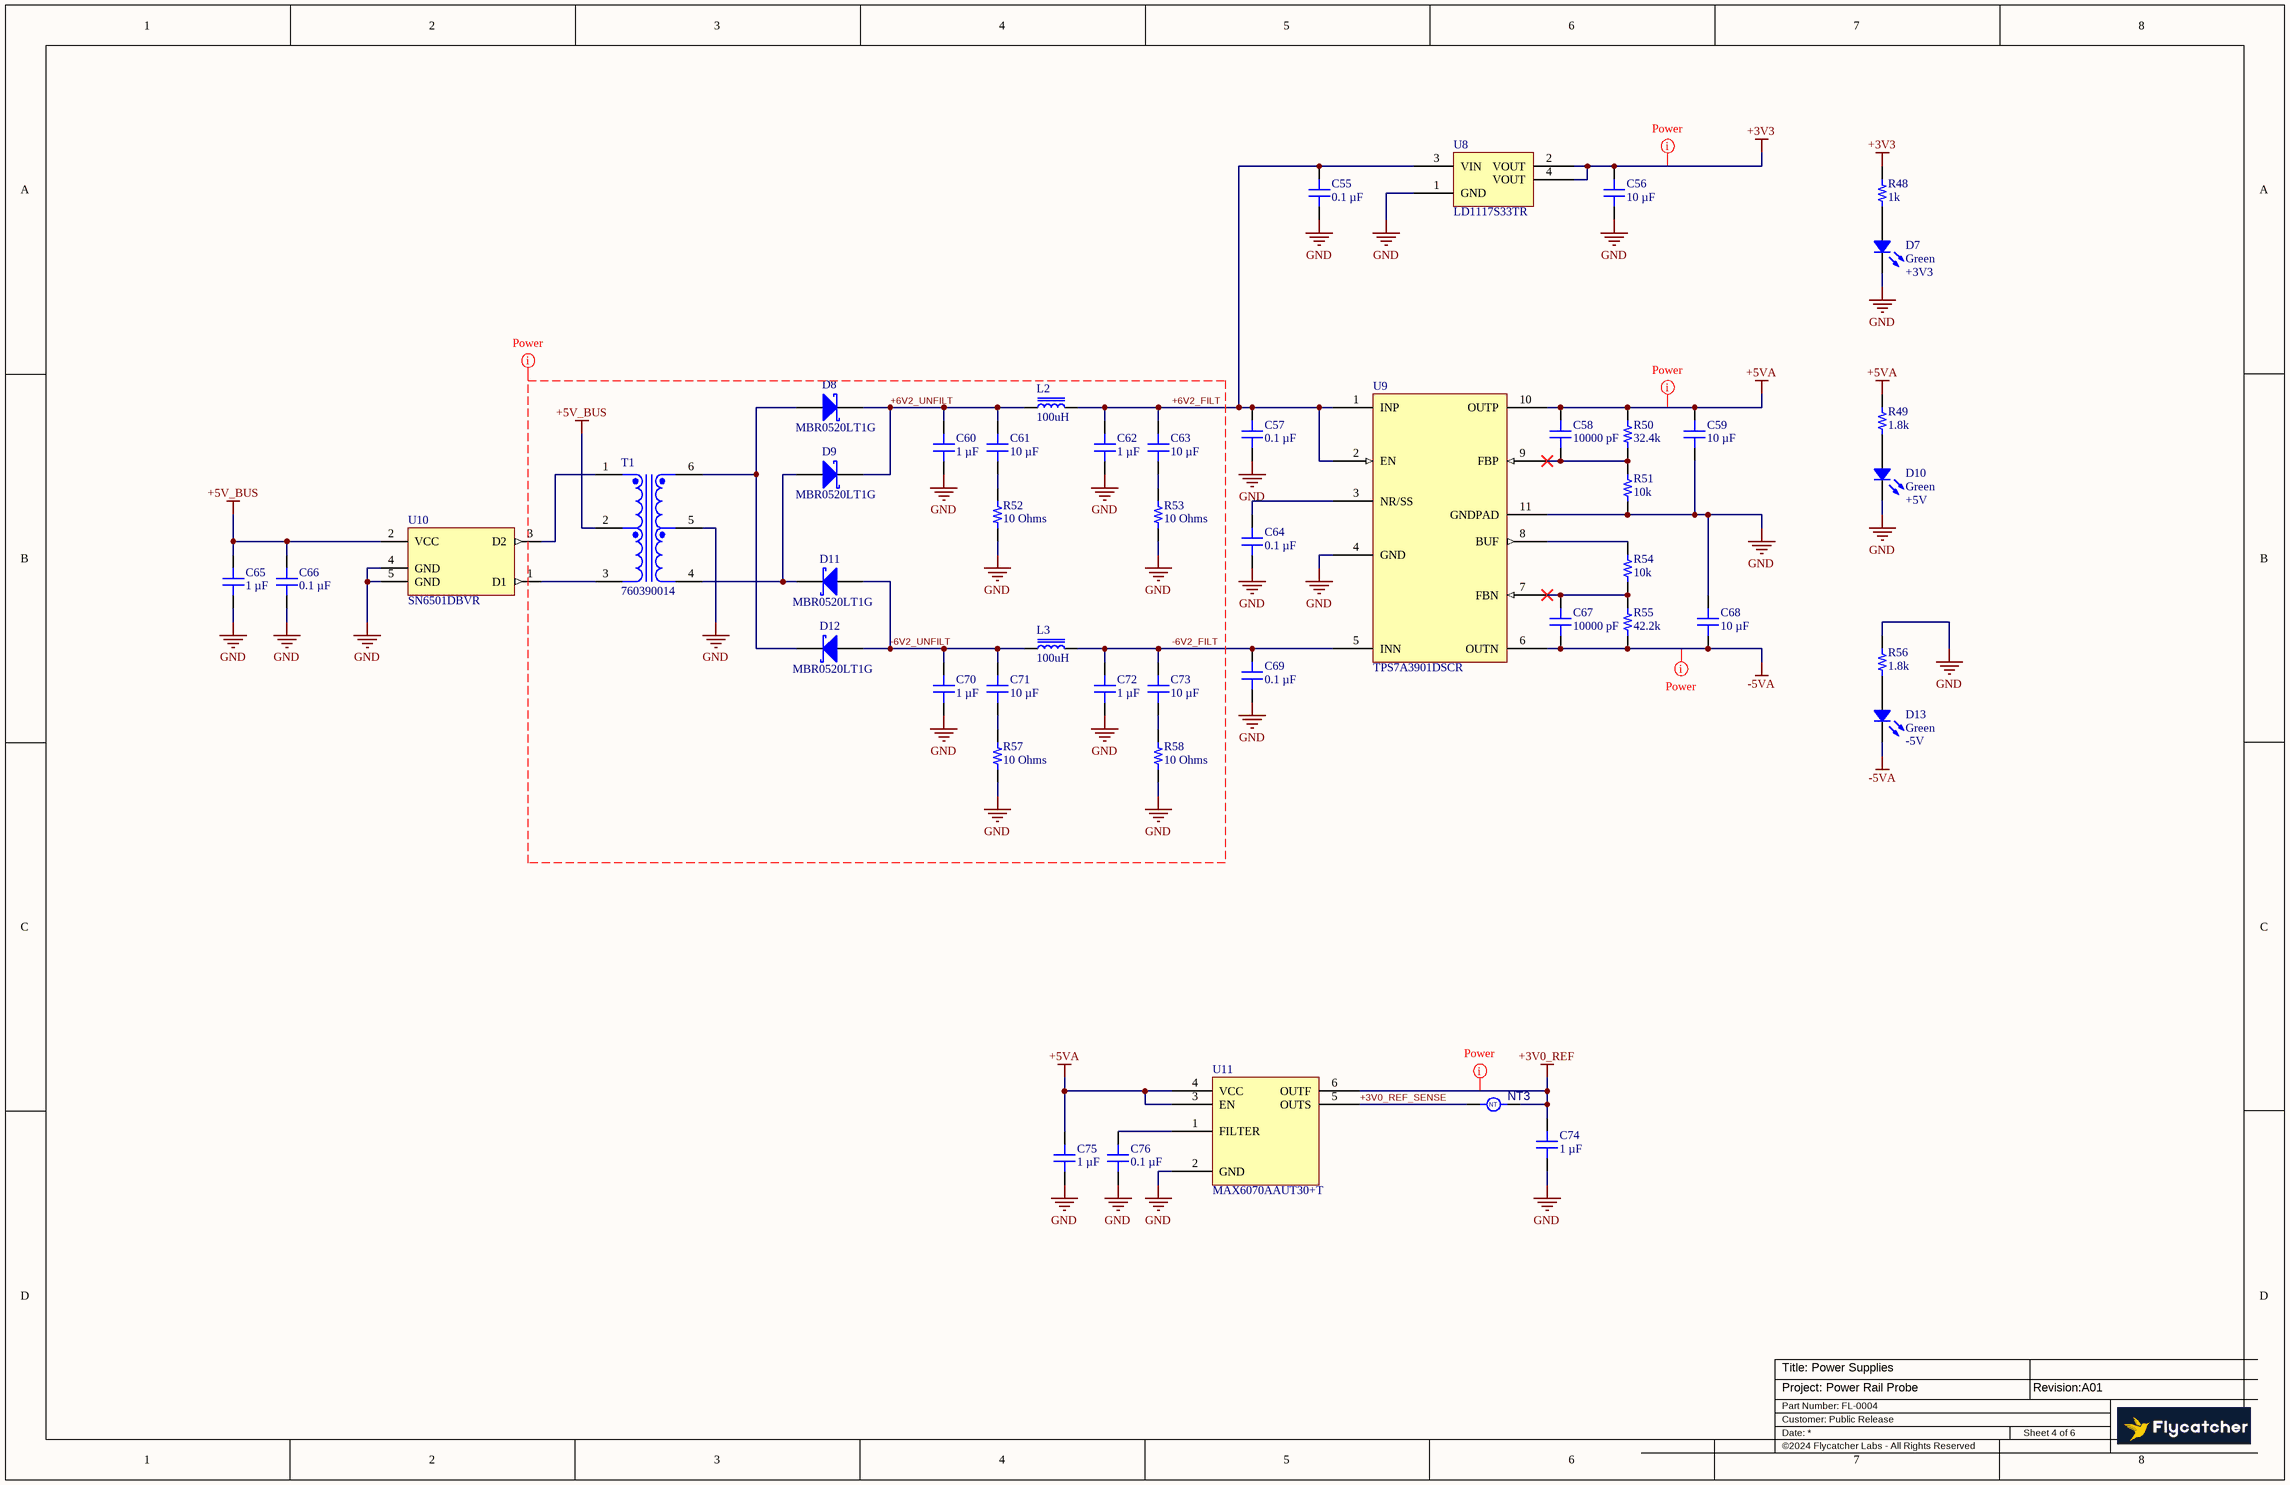
[diagram p4: Power.SchDoc]

### Parts
C55  0.1 µF  [MURATA GRM155 0402_1005]
C56  10 µF  [CAP 0805_2012]
C57  0.1 µF  [MURATA GRM155 0402_1005]
C58  10000 pF  [MURATA GRM155 0402_1005]
C59  10 µF  [CAP 0805_2012]
C60  1 µF  [MURATA GRM155 0402_1005]
C61  10 µF  [CAP 0805_2012]
C62  1 µF  [MURATA GRM155 0402_1005]
C63  10 µF  [CAP 0805_2012]
C64  0.1 µF  [MURATA GRM155 0402_1005]
C65  1 µF  [MURATA GRM155 0402_1005]
C66  0.1 µF  [MURATA GRM155 0402_1005]
C67  10000 pF  [MURATA GRM155 0402_1005]
C68  10 µF  [CAP 0805_2012]
C69  0.1 µF  [MURATA GRM155 0402_1005]
C70  1 µF  [MURATA GRM155 0402_1005]
C71  10 µF  [CAP 0805_2012]
C72  1 µF  [MURATA GRM155 0402_1005]
C73  10 µF  [CAP 0805_2012]
C74  1 µF  [MURATA GRM155 0402_1005]
C75  1 µF  [MURATA GRM155 0402_1005]
C76  0.1 µF  [MURATA GRM155 0402_1005]
D7  +3V3  value Green  [LED 0402_1005 GREEN]
D8  MBR0520LT1G  [ONSC-SOD-123-2-425-04_V]
D9  MBR0520LT1G  [ONSC-SOD-123-2-425-04_V]
D10  +5V  value Green  [LED 0402_1005 GREEN]
D11  MBR0520LT1G  [ONSC-SOD-123-2-425-04_V]
D12  MBR0520LT1G  [ONSC-SOD-123-2-425-04_V]
D13  -5V  value Green  [LED 0402_1005 GREEN]
L2  value 100uH  [FP-SRN4030HA-MFG]  (hidden comment: SRN4030HA-101M)
L3  value 100uH  [FP-SRN4030HA-MFG]  (hidden comment: SRN4030HA-101M)
NT3  Net Tie 10x8mil  [New footprint 1]  (value not drawn)  (net tie, no BOM)
R48  1k  [RES 0402_1005]
R49  1.8k  [RES 0402_1005]
R50  32.4k  [RES 0402_1005]
R51  10k  [RES 0402_1005]
R52  10 Ohms  [RES 0402_1005]
R53  10 Ohms  [RES 0402_1005]
R54  10k  [RES 0402_1005]
R55  42.2k  [RES 0402_1005]
R56  1.8k  [RES 0402_1005]
R57  10 Ohms  [RES 0402_1005]
R58  10 Ohms  [RES 0402_1005]
T1  760390014  [WE-760390014-6_V]
U8  LD1117S33TR  [ST SOT-223]
U9  TPS7A3901DSCR  [FP-DSC0010J-MFG]
U10  SN6501DBVR  [FP-DBV0005A-MFG]
U11  MAX6070AAUT30+T  [MAXIM SOT-23-6]

### Nets
+3V0_REF: C74.2 NT3.2 U11.6(OUTF)
+3V3: C56.2 R48.2 U8.2(VOUT) U8.4(VOUT)
+5V_BUS: C65.2 C66.2 T1.2 U10.2(VCC)
+5VA: C58.2 C59.2 C75.2 R49.2 R50.2 U9.10(OUTP) U11.3(EN) U11.4(VCC)
-5VA: C67.1 C68.1 D13.2 R55.1 U9.6(OUTN)
GND: C55.1 C56.1 C57.1 C59.1 C60.1 C62.1 C64.1 C65.1 C66.1 C68.2 C69.1 C70.1 C72.1 C74.1 C75.1 C76.1 D7.2 D10.2 R51.2 R52.1 R53.1 R56.2 R57.1 R58.1 T1.5 U8.1(GND) U9.4(GND) U9.11(GNDPAD) U10.4(GND) U10.5(GND) U11.2(GND)
+3V0_REF_SENSE: NT3.1 U11.5(OUTS)
+6V2_FILT: C55.2 C57.2 C62.2 C63.2 L2.2 U8.3(VIN) U9.1(INP) U9.2(EN)
+6V2_UNFILT: C60.2 C61.2 D8.2(K) D9.2(K) L2.1
-6V2_FILT: C69.2 C72.2 C73.2 L3.2 U9.5(INN)
-6V2_UNFILT: C70.2 C71.2 D11.1(A) D12.1(A) L3.1
NetC58_1: C58.1 R50.1 R51.1 U9.9(FBP)
NetC61_1: C61.1 R52.2
NetC63_1: C63.1 R53.2
NetC64_2: C64.2 U9.3(NR/SS)
NetC67_2: C67.2 R54.2 R55.2 U9.7(FBN)
NetC71_1: C71.1 R57.2
NetC73_1: C73.1 R58.2
NetC76_2: C76.2 U11.1(FILTER)
NetD7_1: D7.1 R48.1
NetD8_1: D8.1(A) D12.2(K) T1.6
NetD9_1: D9.1(A) D11.2(K) T1.4
NetD10_1: D10.1 R49.1
NetD13_1: D13.1 R56.1
NetR54_1: R54.1 U9.8(BUF)
NetT1_1: T1.1 U10.3(D2)
NetT1_3: T1.3 U10.1(D1)

### Layout directives
net class Power: +3V0_REF, +3V3, +5V_BUS, +5VA, +6V2_FILT, +6V2_UNFILT, -5VA, -6V2_FILT, -6V2_UNFILT, GND

### Notes on the sheet
- (in symbol CMP-009-00116-4) NT

### Library data of the parts
C55 C57 C64 C66 C69 C76 = GRM155R61H104KE19D: as C29 on sheet Microcontroller; Part Number: GRM155R61H104KE19D; Value: 0.1 µF; Applications: General Purpose; Capacitance: 0.1 µF; componentlink1description: Datasheet; componentlink1url: https://search.murata.co.jp/Ceramy/image/img/A01X/G101/ENG/GRM155R61H104KE19-01.pdf; componentlink2description: DigiKey Link; componentlink2url: https://www.digikey.com/en/products/detail/murata-electronics/GRM155R61H104KE19D/5360887; Device Package: 0402 (1005 Metric); lastupdated: 7/25/2024 4:50:24 AM; Lifecycle Status: Active; Minimum Order: 1; Mounting Type: Surface Mount, MLCC; Operating Temperature: -55°C ~ 85°C; Package / Case: 0402 (1005 Metric); packaging: TapeAndReel; partid: 2975; Part Status: Active; price: 0.01; series: GRM; Size / Dimension: 0.039" L x 0.020" W (1.00mm x 0.50mm); Supplier 1: DigiKey; Supplier Part Number 1: 490-11917-1-ND; Temperature Coefficient: X5R; Thickness (Max): 0.022" (0.55mm); Voltage - Rated: 50V
C56 C59 C61 C63 C68 C71 C73 = GCM21BC71E106KE36L: CAP CER 10UF 25V X7S 0805; manufacturer: Murata Electronics; Tolerance: ±10%; Part Number: GCM21BC71E106KE36L; Value: 10 µF; Applications: Automotive; Capacitance: 10 µF; componentlink1description: Datasheet; componentlink1url: https://search.murata.co.jp/Ceramy/image/img/A01X/G101/ENG/GCM21BC71E106KE36-01A.pdf; componentlink2description: DigiKey Link; componentlink2url: https://www.digikey.com/en/products/detail/murata-electronics/GCM21BC71E106KE36L/16821116; Device Package: 0805 (2012 Metric); lastupdated: 2/9/2024 8:14:44 PM; Lifecycle Status: Active; Minimum Order: 1; Mounting Type: Surface Mount, MLCC; Operating Temperature: -55°C ~ 125°C; Package / Case: 0805 (2012 Metric); packaging: TapeAndReel; partid: 48794; Part Status: Active; price: 0.09; Ratings: AEC-Q200; series: GCM; Size / Dimension: 0.079" L x 0.049" W (2.00mm x 1.25mm); Supplier 1: DigiKey; Supplier Part Number 1: 490-GCM21BC71E106KE36LCT-ND; Temperature Coefficient: X7S; Thickness (Max): 0.057" (1.45mm); Voltage - Rated: 25V
C58 C67 = GRM1555CYA103GE01D: CAP CER 10000PF 35V C0G/NP0 0402; manufacturer: Murata Electronics; Temperature Coefficient: C0G, NP0; Tolerance: ±2%; Part Number: GRM1555CYA103GE01D; Value: 10000 pF; Applications: General Purpose; Capacitance: 10000 pF; componentlink1description: Datasheet; componentlink1url: https://search.murata.co.jp/Ceramy/image/img/A01X/G101/ENG/GRM1555CYA103GE01-01A.pdf; componentlink2description: DigiKey Link; componentlink2url: https://www.digikey.com/en/products/detail/murata-electronics/GRM1555CYA103GE01D/16033798; Device Package: 0402 (1005 Metric); lastupdated: 8/27/2024 12:42:50 PM; Lifecycle Status: Active; Minimum Order: 1; Mounting Type: Surface Mount, MLCC; Operating Temperature: -55°C ~ 125°C; Package / Case: 0402 (1005 Metric); packaging: TapeAndReel; partid: 41078; Part Status: Active; price: 0.02; series: GRM; Size / Dimension: 0.039" L x 0.020" W (1.00mm x 0.50mm); Supplier 1: DigiKey; Supplier Part Number 1: 490-GRM1555CYA103GE01DCT-ND; Thickness (Max): 0.026" (0.65mm); Voltage - Rated: 35V
C60 C62 C65 C70 C72 C74 C75 = GRM155R61E105MA12D: as C27 on sheet Microcontroller; Part Number: GRM155R61E105MA12D; Value: 1 µF; Applications: General Purpose; Capacitance: 1 µF; componentlink1description: Datasheet; componentlink1url: https://search.murata.co.jp/Ceramy/image/img/A01X/G101/ENG/GRM155R61E105MA12-01.pdf; componentlink2description: DigiKey Link; componentlink2url: https://www.digikey.com/en/products/detail/murata-electronics/GRM155R61E105MA12D/4905141; Device Package: 0402 (1005 Metric); lastupdated: 7/25/2024 4:50:24 AM; Lifecycle Status: Active; Minimum Order: 1; Mounting Type: Surface Mount, MLCC; Operating Temperature: -55°C ~ 85°C; Package / Case: 0402 (1005 Metric); packaging: TapeAndReel; partid: 3014; Part Status: Active; price: 0.01; series: GRM; Size / Dimension: 0.039" L x 0.020" W (1.00mm x 0.50mm); Supplier 1: DigiKey; Supplier Part Number 1: 490-10018-1-ND; Temperature Coefficient: X5R; Thickness (Max): 0.022" (0.55mm); Voltage - Rated: 25V
D7 D10 D13 = HSMG-C280: LED GREEN DIFFUSED 0402 SMD; Manufacturer: Broadcom Limited; Configuration: Standard; Current - Test: 20mA; Lens Color: White; Lens Size: 1.00mm x 0.50mm; Lens Style: Rectangle with Flat Top; Millicandela Rating: 15mcd; Viewing Angle: 130°; Voltage - Forward (Vf) (Typ): 2.2V; Wavelength - Dominant: 572nm; Wavelength - Peak: 570nm; Part Number: HSMG-C280; Color: Green; ComponentLink1Description: Datasheet; ComponentLink1URL: https://docs.broadcom.com/docs/AV02-0602EN; ComponentLink2Description: DigiKey Link; ComponentLink2URL: https://www.digikey.com/en/products/detail/broadcom-limited/HSMG-C280/1235358; Device Package: 0402 (1005 Metric); Height (Max): 0.40mm; LastUpdated: 3/11/2024 7:50:32 AM; Lens Transparency: Diffused; Lifecycle Status: Active; Minimum Order: 1; Mounting Type: Surface Mount; Package / Case: 0402 (1005 Metric); Packaging: TapeAndReel; PartId: 697; Part Status: Active; Price: 0.08; Series: -; Size / Dimension: 1.00mm L x 0.50mm W; Supplier 1: DigiKey; Supplier Part Number 1: 516-3066-1-ND; Supplier Device Package: 0402
D8 D9 D11 D12 = CMP-004-00003-2: as D3 on sheet Microcontroller; Max Operating Temperature: 125°C; Min Operating Temperature: -65°C; Mounting Technology: SM; Datasheet URL: http://www.onsemi.cn/pub_link/Collateral/MBR0520LT1-D.PDF; RoHS Compliant: True; Pins: 2; Package Quantity: 3000; Case/Package: SOD; Package Reference: SOD-123-2-425-04; Package Description: 2-Pin Surface Mount Device, Body 2.69 x 1.6 mm; Packaging: TapeandReel; Manufacturer URL: http://www.onsemi.com/; Datasheet Version: Rev. 6, 01/2012
L2 L3 = CMP-006-00029-3: Inductor Power Semi-Shielded Wirewound 100uH 20% 100kHz 26Q Factor Ferrite 0.55A SMD T/R; Manufacturer: Bourns; Current Saturation: 700mA; Self Resonant Frequency: 7MHz; Current Rating: 550mA; Manufacturer Part Number: SRN4030HA-101M; ComponentLink1Description: Datasheet; ComponentLink1URL: https://mm.digikey.com/Volume0/opasdata/d220001/medias/docus/5336/SRN4030HA_Series_DS.pdf; Case/Package: 4mm x 4mm
NT3 = CMP-009-00116-4: Pins: 2; Max Operating Temperature: 155°C; Min Operating Temperature: -55°C; ClassName: NetTie
R48 = ERA-2AEB102X: as R43 on sheet Microcontroller; Part Number: ERA-2AEB102X; ComponentLink1Description: Datasheet; ComponentLink1URL: https://industrial.panasonic.com/cdbs/www-data/pdf/RDM0000/AOA0000C307.pdf; ComponentLink2Description: DigiKey Link; ComponentLink2URL: https://www.digikey.com/en/products/detail/panasonic-electronic-components/ERA-2AEB102X/1706005; Composition: Thin Film; Device Package: 0402 (1005 Metric); Features: Automotive AEC-Q200; Height - Seated (Max): 0.016" (0.40mm); LastUpdated: 2/9/2024 8:30:08 PM; Lifecycle Status: Active; Minimum Order: 1; Number of Terminations: 2; Operating Temperature: -55°C ~ 155°C; Package / Case: 0402 (1005 Metric); Packaging: TapeAndReel; PartId: 6077; Part Status: Active; Price: 0.04; Ratings: AEC-Q200; Resistance: 1 kOhms; Series: ERA-2A; Size / Dimension: 0.039" L x 0.020" W (1.00mm x 0.50mm); Supplier 1: DigiKey; Supplier Part Number 1: P1.0KDCCT-ND; Supplier Device Package: 0402; Tolerance: ±0.1%
R49 R56 = CRCW04021K80FKED: RES SMD 1.8K OHM 1% 1/16W 0402; Manufacturer: Vishay Dale; Value: 1.8 kOhms; Power (Watts): 0.063W, 1/16W; Temperature Coefficient: ±100ppm/°C; Part Number: CRCW04021K80FKED; ComponentLink1Description: Datasheet; ComponentLink1URL: http://www.vishay.com/docs/20035/dcrcwe3.pdf; ComponentLink2Description: DigiKey Link; ComponentLink2URL: https://www.digikey.com/en/products/detail/vishay-dale/CRCW04021K80FKED/1178034; Composition: Thick Film; Device Package: 0402 (1005 Metric); Features: Automotive AEC-Q200; Height - Seated (Max): 0.016" (0.40mm); LastUpdated: 2/9/2024 8:29:55 PM; Lifecycle Status: Active; Minimum Order: 1; Number of Terminations: 2; Operating Temperature: -55°C ~ 155°C; Package / Case: 0402 (1005 Metric); Packaging: TapeAndReel; PartId: 10328; Part Status: Active; Price: 0.01; Ratings: AEC-Q200; Resistance: 1.8 kOhms; Series: CRCW; Size / Dimension: 0.039" L x 0.020" W (1.00mm x 0.50mm); Supplier 1: DigiKey; Supplier Part Number 1: 541-1.80KLCT-ND; Supplier Device Package: 0402; Tolerance: ±1%
R50 = CRCW040232K4FKED: RES SMD 32.4K OHM 1% 1/16W 0402; Manufacturer: Vishay Dale; Value: 32.4 kOhms; Power (Watts): 0.063W, 1/16W; Temperature Coefficient: ±100ppm/°C; Part Number: CRCW040232K4FKED; ComponentLink1Description: Datasheet; ComponentLink1URL: http://www.vishay.com/docs/20035/dcrcwe3.pdf; ComponentLink2Description: DigiKey Link; ComponentLink2URL: https://www.digikey.com/en/products/detail/vishay-dale/CRCW040232K4FKED/1178177; Composition: Thick Film; Device Package: 0402 (1005 Metric); Features: Automotive AEC-Q200; Height - Seated (Max): 0.016" (0.40mm); LastUpdated: 2/9/2024 8:29:30 PM; Lifecycle Status: Active; Minimum Order: 1; Number of Terminations: 2; Operating Temperature: -55°C ~ 155°C; Package / Case: 0402 (1005 Metric); Packaging: TapeAndReel; PartId: 18805; Part Status: Active; Price: 0.01; Ratings: AEC-Q200; Resistance: 32.4 kOhms; Series: CRCW; Size / Dimension: 0.039" L x 0.020" W (1.00mm x 0.50mm); Supplier 1: DigiKey; Supplier Part Number 1: 541-32.4KLCT-ND; Supplier Device Package: 0402; Tolerance: ±1%
R51 R54 = ERA-2VRW1002X: as R35 on sheet Microcontroller; Part Number: ERA-2VRW1002X; ComponentLink1Description: Datasheet; ComponentLink1URL: https://api.pim.na.industrial.panasonic.com/file_stream/main/fileversion/9152; ComponentLink2Description: DigiKey Link; ComponentLink2URL: https://www.digikey.com/en/products/detail/panasonic-electronic-components/ERA-2VRW1002X/12085128; Composition: Thin Film; Device Package: 0402 (1005 Metric); Height - Seated (Max): 0.016" (0.40mm); LastUpdated: 2/9/2024 8:28:44 PM; Lifecycle Status: Active; Minimum Order: 1; Number of Terminations: 2; Operating Temperature: -55°C ~ 155°C; Package / Case: 0402 (1005 Metric); Packaging: TapeAndReel; PartId: 70282; Part Status: Active; Price: 0.21; Resistance: 10 kOhms; Series: ERA-2V; Size / Dimension: 0.039" L x 0.020" W (1.00mm x 0.50mm); Supplier 1: DigiKey; Supplier Part Number 1: 10-ERA-2VRW1002XCT-ND; Supplier Device Package: 0402; Tolerance: ±0.05%; Features: Anti-Sulfur, Automotive AEC-Q200; Ratings: AEC-Q200
R52 R53 R57 R58 = CRCW040210R0FKEDC: RES 10 OHM 1% 1/16W 0402; Manufacturer: Vishay Dale; Power (Watts): 0.063W, 1/16W; Temperature Coefficient: ±100ppm/°C; Part Number: CRCW040210R0FKEDC; Value: 10 Ohms; ComponentLink1Description: Datasheet; ComponentLink1URL: http://www.vishay.com/docs/28773/crcwce3.pdf; ComponentLink2Description: DigiKey Link; ComponentLink2URL: https://www.digikey.com/en/products/detail/vishay-dale/CRCW040210R0FKEDC/7928386; Composition: Thick Film; Device Package: 0402 (1005 Metric); Height - Seated (Max): 0.014" (0.35mm); LastUpdated: 2/9/2024 8:29:48 PM; Lifecycle Status: Active; Minimum Order: 1; Number of Terminations: 2; Operating Temperature: -55°C ~ 155°C; Package / Case: 0402 (1005 Metric); Packaging: CutTape; PartId: 12688; Part Status: Active; Price: 0.01; Resistance: 10 Ohms; Series: CRCW-C; Size / Dimension: 0.039" L x 0.020" W (1.00mm x 0.50mm); Supplier 1: DigiKey; Supplier Part Number 1: 541-3964-1-ND; Supplier Device Package: 0402; Tolerance: ±1%
R55 = CRCW040242K2FKED: RES SMD 42.2K OHM 1% 1/16W 0402; Manufacturer: Vishay Dale; Value: 42.2 kOhms; Power (Watts): 0.063W, 1/16W; Temperature Coefficient: ±100ppm/°C; Part Number: CRCW040242K2FKED; ComponentLink1Description: Datasheet; ComponentLink1URL: http://www.vishay.com/docs/20035/dcrcwe3.pdf; ComponentLink2Description: DigiKey Link; ComponentLink2URL: https://www.digikey.com/en/products/detail/vishay-dale/CRCW040242K2FKED/1178191; Composition: Thick Film; Device Package: 0402 (1005 Metric); Features: Automotive AEC-Q200; Height - Seated (Max): 0.016" (0.40mm); LastUpdated: 2/9/2024 8:29:54 PM; Lifecycle Status: Active; Minimum Order: 1; Number of Terminations: 2; Operating Temperature: -55°C ~ 155°C; Package / Case: 0402 (1005 Metric); Packaging: TapeAndReel; PartId: 10469; Part Status: Active; Price: 0.01; Ratings: AEC-Q200; Resistance: 42.2 kOhms; Series: CRCW; Size / Dimension: 0.039" L x 0.020" W (1.00mm x 0.50mm); Supplier 1: DigiKey; Supplier Part Number 1: 541-42.2KLCT-ND; Supplier Device Package: 0402; Tolerance: ±1%
T1 = CMP-012-00005-3: Audio & Signal Transformer, 475 uH, -40 to 125 degC, 6-Pin SMD, RoHS, Tape and Reel; Manufacturer: Wuerth Elektronik; Inductance: 475uH; Mounting Technology: SurfaceMount; Datasheet URL: https://datasheet.ciiva.com/12335/760390014-221199-12335395.pdf; Package Reference: 760390014; Package Description: 6-Pin Surface Mounted Device, Body 7.14 x 6.73 mm, Pitch 2.54 mm; Min Operating Temperature: -40°C; RoHS Compliant: True; Max Operating Temperature: 125°C; Pins: 6; Case/Package: SMD; Datasheet Version: Rev. 6C, 06/2013
U8 = LD1117S33TR: IC REG LINEAR 3.3V 800MA SOT223; Manufacturer: STMicroelectronics; Current - Quiescent (Iq): 10 mA; Number of Regulators: 1; Output Configuration: Positive; Output Type: Fixed; Protection Features: Over Current, Over Temperature; PSRR: 75dB (120Hz); Voltage Dropout (Max): 1.2V @ 800mA; Voltage - Input (Max): 15V; Part Number: LD1117S33TR; ComponentLink1Description: Datasheet; ComponentLink1URL: http://www.st.com/content/ccc/resource/technical/document/datasheet/99/3b/7d/91/91/51/4b/be/CD00000544.pdf/files/CD00000544.pdf/jcr:content/translations/en.CD00000544.pdf; ComponentLink2Description: DigiKey Link; ComponentLink2URL: https://www.digikey.com/en/products/detail/stmicroelectronics/LD1117S33TR/585766; Current - Output: 800mA; LastUpdated: 6/3/2024 8:14:20 PM; Lifecycle Status: Active; Minimum Order: 1; Mounting Type: Surface Mount; Operating Temperature: 0°C ~ 125°C; Package / Case: TO-261-4, TO-261AA; Packaging: TapeAndReel; Part Status: Active; Price: 0.13; Series: -; Supplier 1: DigiKey; Supplier Part Number 1: 497-1242-1-ND; Supplier Device Package: SOT-223; Voltage - Output (Min/Fixed): 3.3V
U9 = CMP-019-00059-2: Adjustable Positive LDO Regulator, 1.2V Min, 30V Max, 0.5V Dropout, BIPolar, PDSO10; Number of Channels: 2; Max Supply Voltage: 33V; Min Output Voltage: 0V; Power Supply Rejection Ratio (PSRR): 69dB; Accuracy: 2.5%; Quiescent Current: 150uA; Output Current: 150mA; Min Supply Voltage: 3.3V; Max Output Voltage: -30V; Max Supply Current: 904uA; Mounting Technology: Surface Mount; Series: -; ComponentLink1Description: Datasheet; Pins: 10; Min Operating Temperature: -40°C; Output Type: Adjustable; Packaging: Cut Tape; Length: 3mm; Height: 800um; Max Operating Temperature: 125°C; Number of Outputs: 2; Thickness: 750um; Width: 3mm; Number of Regulators: 2; ComponentLink1URL: https://www.ti.com/lit/ds/symlink/tps7a39.pdf
U10 = CMP-019-00057-2: Transformer Driver PMIC SOT-23-5; Min Supply Voltage: 3V; Max Output current: 350mA; Max Power Dissipation: 250mW; Max Supply Voltage: 5.5V; Output Type: Adjustable; Number of Outputs: 1; Output Current: 250mA; Switching Frequency: 620kHz; Output Voltage: 11V; Operating Supply Current: 300uA; Max Operating Temperature: 125°C; Height: 1.45mm; Min Operating Temperature: -40°C; ComponentLink1URL: https://www.ti.com/lit/ds/symlink/sn6501.pdf; Package Quantity: 3000; Packaging: Tape and Reel; Thickness: 1.2mm; Series: -; Mounting Technology: Surface Mount; Width: 1.6mm; Case/Package: SOT-23-5; Reach SVHC Compliant: No; ComponentLink1Description: Datasheet; Lead Free: Lead Free; Length: 2.9mm; RoHS Compliant: Yes; Min Input Voltage: 3V; Pins: 5
U11 = MAX6070AAUT30+T: IC VREF SERIES 0.04% SOT23-6; Manufacturer: Maxim Integrated; Current - Output: 10mA; Current - Supply: 300µA; Noise - 0.1Hz to 10Hz: 4.6µVp-p; Noise - 10Hz to 10kHz: 5µVrms; Output Type: Fixed; Temperature Coefficient: 6ppm/°C; Voltage - Input: 3.2V ~ 5.5V; Voltage - Output (Min/Fixed): 3V; Part Number: MAX6070AAUT30+T; ComponentLink1Description: Datasheet; ComponentLink1URL: https://datasheets.maximintegrated.com/en/ds/MAX6070-MAX6071.pdf; ComponentLink2Description: DigiKey Link; ComponentLink2URL: http://digikey.com/product-detail/en/maxim-integrated/MAX6070AAUT30-T/MAX6070AAUT30-TCT-ND/5051499; LastUpdated: 6/3/2024 8:15:04 PM; Lifecycle Status: Active; Minimum Order: 1; Mounting Type: Surface Mount; Operating Temperature: -40°C ~ 125°C (TA); Package / Case: SOT-23-6; Packaging: CutTape; Part Status: Active; Price: 3.63; Reference Type: Series; Series: -; Supplier 1: DigiKey; Supplier Part Number 1: MAX6070AAUT30+TCT-ND; Supplier Device Package: SOT-23-6; Tolerance: ±0.04%